# Altium schematic sheet Servo_driver.SchDoc
size A3
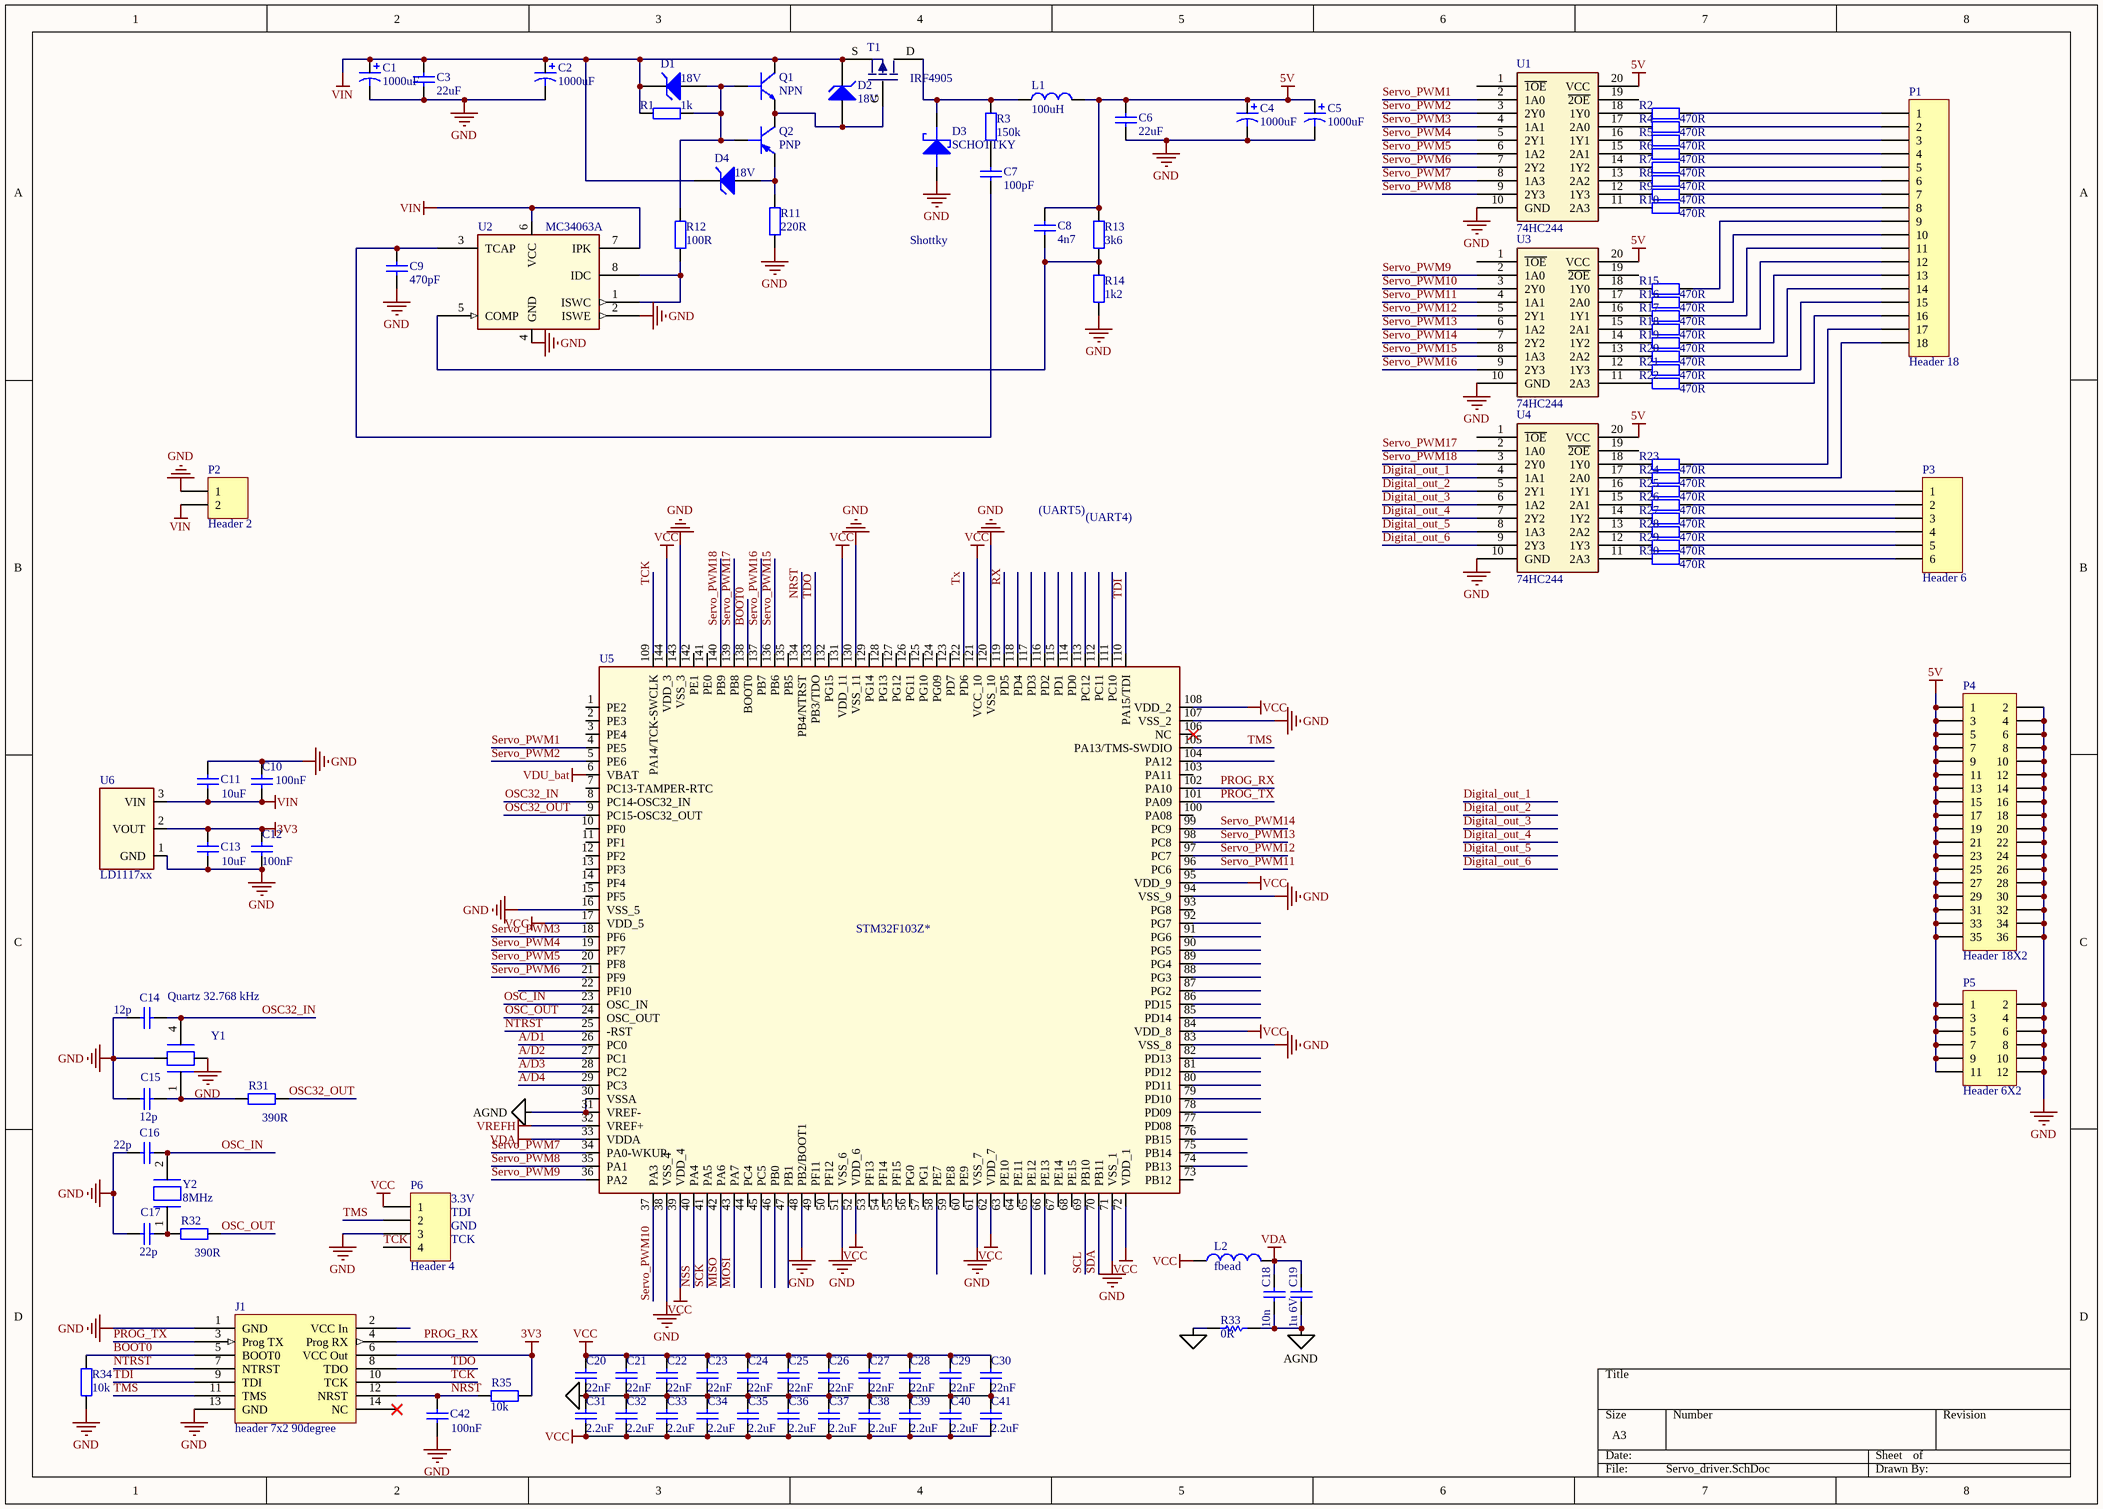
[diagram p0: Servo_driver.SchDoc]

## Parts
C1  1000uF  [cap_10x12]
C2  1000uF  [cap_10x12]
C3  22uF  [FP_1210_CAP_N]
C4  1000uF  [cap_10x12]
C5  1000uF  [cap_10x12]
C6  22uF  [FP_1210_CAP_N]
C7  100pF  [FP_0603_CAP_080]
C8  4n7  [FP_0603_CAP_080]
C9  470pF  [FP_0603_CAP_080]
C10  100nF  [FP_0603_CAP_080]
C11  10uF  [FP_1206_CAP_085]
C12  100nF  [FP_0603_CAP_080]
C13  10uF  [FP_1206_CAP_085]
C14  12p  [FP_0603_CAP_080]
C15  12p  [FP_0603_CAP_080]
C16  22p  [FP_0603_CAP_080]
C17  22p  [FP_0603_CAP_080]
C18  10n  [FP_0603_CAP_080]
C19  1u 6V  [FP_0603_CAP_080]
C20  22nF  [FP_0603_CAP_080]
C21  22nF  [FP_0603_CAP_080]
C22  22nF  [FP_0603_CAP_080]
C23  22nF  [FP_0603_CAP_080]
C24  22nF  [FP_0603_CAP_080]
C25  22nF  [FP_0603_CAP_080]
C26  22nF  [FP_0603_CAP_080]
C27  22nF  [FP_0603_CAP_080]
C28  22nF  [FP_0603_CAP_080]
C29  22nF  [FP_0603_CAP_080]
C30  22nF  [FP_0603_CAP_080]
C31  2.2uF  [FP_0603_CAP_080]
C32  2.2uF  [FP_0603_CAP_080]
C33  2.2uF  [FP_0603_CAP_080]
C34  2.2uF  [FP_0603_CAP_080]
C35  2.2uF  [FP_0603_CAP_080]
C36  2.2uF  [FP_0603_CAP_080]
C37  2.2uF  [FP_0603_CAP_080]
C38  2.2uF  [FP_0603_CAP_080]
C39  2.2uF  [FP_0603_CAP_080]
C40  2.2uF  [FP_0603_CAP_080]
C41  2.2uF  [FP_0603_CAP_080]
C42  100nF  [FP_0603_CAP_080]
D1  18V  [SOD-80]
D2  18V  [SOD-80]
D3  SCHOTTKY  [DIODE_TO220]
D4  18V  [SOD-80]
J1  header 7x2 90degree  [SMD_header_2x7_narrow]
L1  100uH  [SRR1206_T]
L2  fbead  [FP_0805_RES_SIMPLE]
P1  Header 18  [HDR1X18]
P2  Header 2  [Sorkapocs 2P 5mm]
P3  Header 6  [HDR1X6]
P4  Header 18X2  [HDR2X18]
P5  Header 6X2  [HDR2X6]
P6  Header 4  [HDR1X4]
Q1  NPN  [TR_SOT23]
Q2  PNP  [TR_SOT23]
R1  1k  [FP_1206_RES]
R2  470R  [FP_0603_RES]
R3  150k  [FP_0603_RES]
R4  470R  [FP_0603_RES]
R5  470R  [FP_0603_RES]
R6  470R  [FP_0603_RES]
R7  470R  [FP_0603_RES]
R8  470R  [FP_0603_RES]
R9  470R  [FP_0603_RES]
R10  470R  [FP_0603_RES]
R11  220R  [FP_1206_RES]
R12  100R  [FP_1206_RES]
R13  3k6  [FP_0603_RES]
R14  1k2  [FP_0603_RES]
R15  470R  [FP_0603_RES]
R16  470R  [FP_0603_RES]
R17  470R  [FP_0603_RES]
R18  470R  [FP_0603_RES]
R19  470R  [FP_0603_RES]
R20  470R  [FP_0603_RES]
R21  470R  [FP_0603_RES]
R22  470R  [FP_0603_RES]
R23  470R  [FP_0603_RES]
R24  470R  [FP_0603_RES]
R25  470R  [FP_0603_RES]
R26  470R  [FP_0603_RES]
R27  470R  [FP_0603_RES]
R28  470R  [FP_0603_RES]
R29  470R  [FP_0603_RES]
R30  470R  [FP_0603_RES]
R31  390R  [FP_0603_RES]
R32  390R  [FP_0603_RES]
R33  0R  [FP_0603_RES]
R34  10k  [FP_0603_RES]
R35  10k  [FP_0603_RES]
T1  IRF4905  [FET_TO220]
U1  74HC244  [DIGITAL_SOIC20W]
U2  MC34063A  [FP_SO8_MS012AA]
U3  74HC244  [DIGITAL_SOIC20W]
U4  74HC244  [DIGITAL_SOIC20W]
U5  STM32F103Z*  [LQFP144]
U6  LD1117xx  [SUPPLY_SOT223]
Y1  Quartz 32.768 kHz  [XTAL_ABS25]
Y2  value 8MHz  [FP_CRYSTAL_HC49_SMD]  (hidden comment: 8MHz Quartz HC49)

## Nets
3V3: C12.1 C13.2 J1.6(VCC_Out) R35.2 U6.2(VOUT)
5V: C4.P C5.P C6.2 C8.2 L1.2 P4.1 P4.3 P4.5 P4.7 P4.9 P4.11 P4.13 P4.15 P4.17 P4.19 P4.21 P4.23 P4.25 P4.27 P4.29 P4.31 P4.33 P4.35 P5.1 P5.3 P5.5 P5.7 P5.9 P5.11 R13.2 U1.20(VCC) U3.20(VCC) U4.20(VCC)
AGND: C18.1 C19.1 R33.1 U5.30(VSSA) U5.31(VREF-)
GND: C1.N C2.N C3.1 C4.N C5.N C6.1 C9.2 C10.1 C11.2 C12.2 C13.1 C14.1 C15.1 C16.1 C17.1 C20.1 C21.1 C22.1 C23.1 C24.1 C25.1 C26.1 C27.1 C28.1 C29.1 C30.1 C31.2 C32.2 C33.2 C34.2 C35.2 C36.2 C37.2 C38.2 C39.2 C40.2 C41.2 C42.2 D3.A J1.1(GND) J1.13(GND) P2.1 P4.2 P4.4 P4.6 P4.8 P4.10 P4.12 P4.14 P4.16 P4.18 P4.20 P4.22 P4.24 P4.26 P4.28 P4.30 P4.32 P4.34 P4.36 P5.2 P5.4 P5.6 P5.8 P5.10 P5.12 P6.3 R11.1 R14.1 R33.2 R34.2 U1.10(GND) U2.2(ISWE) U2.4(GND) U3.10(GND) U4.10(GND) U5.16(VSS_5) U5.38(VSS_4) U5.48(PB2/BOOT1) U5.51(VSS_6) U5.61(VSS_7) U5.71(VSS_1) U5.83(VSS_8) U5.94(VSS_9) U5.107(VSS_2) U5.120(VSS_10) U5.130(VSS_11) U5.143(VSS_3) U6.1(GND) Y1.2 Y1.3
VCC: C20.2 C21.2 C22.2 C23.2 C24.2 C25.2 C26.2 C27.2 C28.2 C29.2 C30.2 C31.1 C32.1 C33.1 C34.1 C35.1 C36.1 C37.1 C38.1 C39.1 C40.1 C41.1 L2.1 P6.1 U5.17(VDD_5) U5.39(VDD_4) U5.52(VDD_6) U5.62(VDD_7) U5.72(VDD_1) U5.84(VDD_8) U5.95(VDD_9) U5.108(VDD_2) U5.121(VCC_10) U5.131(VDD_11) U5.144(VDD_3)
VDA: C18.2 C19.2 L2.2 U5.33(VDDA)
VDU_bat: U5.6(VBAT)
VIN: C1.P C2.P C3.2 C10.2 C11.1 D1.K D2.K D4.K P2.2 Q1.C R1.2 T1.S U2.6(VCC) U2.7(IPK) U6.3(VIN)
VREFH: U5.32(VREF+)
A/D1: U5.26(PC0)
A/D2: U5.27(PC1)
A/D3: U5.28(PC2)
A/D4: U5.29(PC3)
BOOT0: J1.5(BOOT0) R34.1 U5.138(BOOT0)
Digital_out_1: U4.4(1A1)
Digital_out_2: U4.5(2Y1)
Digital_out_3: U4.6(1A2)
Digital_out_4: U4.7(2Y2)
Digital_out_5: U4.8(1A3)
Digital_out_6: U4.9(2Y3)
MISO: U5.42(PA6)
MOSI: U5.43(PA7)
NRST: C42.1 J1.12(NRST) R35.1 U5.134(PB4/NTRST)
NSS: U5.40(PA4)
NTRST: J1.7(NTRST) U5.25(-RST)
OSC32_IN: C14.2 U5.8(PC14-OSC32_IN) Y1.4
OSC32_OUT: R31.1 U5.9(PC15-OSC32_OUT)
OSC_IN: C16.2 U5.23(OSC_IN) Y2.2
OSC_OUT: R32.1 U5.24(OSC_OUT)
PROG_RX: J1.4(Prog_RX) U5.102(PA10)
PROG_TX: J1.3(Prog_TX) U5.101(PA09)
RX: U5.119(PD5)
SCK: U5.41(PA5)
SCL: U5.69(PB10)
SDA: U5.70(PB11)
Servo_PWM1: U1.2(1A0) U5.4(PE5)
Servo_PWM2: U1.3(2Y0) U5.5(PE6)
Servo_PWM3: U1.4(1A1) U5.18(PF6)
Servo_PWM4: U1.5(2Y1) U5.19(PF7)
Servo_PWM5: U1.6(1A2) U5.20(PF8)
Servo_PWM6: U1.7(2Y2) U5.21(PF9)
Servo_PWM7: U1.8(1A3) U5.34(PA0-WKUP)
Servo_PWM8: U1.9(2Y3) U5.35(PA1)
Servo_PWM9: U3.2(1A0) U5.36(PA2)
Servo_PWM10: U3.3(2Y0) U5.37(PA3)
Servo_PWM11: U3.4(1A1) U5.96(PC6)
Servo_PWM12: U3.5(2Y1) U5.97(PC7)
Servo_PWM13: U3.6(1A2) U5.98(PC8)
Servo_PWM14: U3.7(2Y2) U5.99(PC9)
Servo_PWM15: U3.8(1A3) U5.136(PB6)
Servo_PWM16: U3.9(2Y3) U5.137(PB7)
Servo_PWM17: U4.2(1A0) U5.139(PB8)
Servo_PWM18: U4.3(2Y0) U5.140(PB9)
TCK: J1.10(TCK) P6.4 U5.109(PA14/TCK-SWCLK)
TDI: J1.9(TDI) U5.110(PA15/TDI)
TDO: J1.8(TDO) U5.133(PB3/TDO)
TMS: J1.11(TMS) P6.2 U5.105(PA13/TMS-SWDIO)
Tx: U5.122(PD6)
NetC7_1: C7.1 R3.2
NetC7_2: C7.2 C9.1 U2.3(TCAP)
NetC8_1: C8.1 R13.1 R14.2 U2.5(COMP)
NetC15_2: C15.2 R31.2 Y1.1
NetC17_2: C17.2 R32.2 Y2.1
NetD1_A: D1.A Q1.B Q2.B R1.1 R12.2
NetD2_A: D2.A Q1.E Q2.C T1.G
NetD3_K: D3.K L1.1 R3.1 T1.D
NetD4_A: D4.A Q2.E R11.2
NetP1_1: P1.1 R2.2
NetP1_2: P1.2 R4.2
NetP1_3: P1.3 R5.2
NetP1_4: P1.4 R6.2
NetP1_5: P1.5 R7.2
NetP1_6: P1.6 R8.2
NetP1_7: P1.7 R9.2
NetP1_8: P1.8 R10.2
NetP1_9: P1.9 R15.2
NetP1_10: P1.10 R16.2
NetP1_11: P1.11 R17.2
NetP1_12: P1.12 R18.2
NetP1_13: P1.13 R19.2
NetP1_14: P1.14 R20.2
NetP1_15: P1.15 R21.2
NetP1_16: P1.16 R22.2
NetP1_17: P1.17 R23.2
NetP1_18: P1.18 R24.2
NetP3_1: P3.1 R25.2
NetP3_2: P3.2 R26.2
NetP3_3: P3.3 R27.2
NetP3_4: P3.4 R28.2
NetP3_5: P3.5 R29.2
NetP3_6: P3.6 R30.2
NetR2_1: R2.1 U1.18(1Y0)
NetR4_1: R4.1 U1.17(2A0)
NetR5_1: R5.1 U1.16(1Y1)
NetR6_1: R6.1 U1.15(2A1)
NetR7_1: R7.1 U1.14(1Y2)
NetR8_1: R8.1 U1.13(2A2)
NetR9_1: R9.1 U1.12(1Y3)
NetR10_1: R10.1 U1.11(2A3)
NetR12_1: R12.1 U2.1(ISWC) U2.8(IDC)
NetR15_1: R15.1 U3.18(1Y0)
NetR16_1: R16.1 U3.17(2A0)
NetR17_1: R17.1 U3.16(1Y1)
NetR18_1: R18.1 U3.15(2A1)
NetR19_1: R19.1 U3.14(1Y2)
NetR20_1: R20.1 U3.13(2A2)
NetR21_1: R21.1 U3.12(1Y3)
NetR22_1: R22.1 U3.11(2A3)
NetR23_1: R23.1 U4.18(1Y0)
NetR24_1: R24.1 U4.17(2A0)
NetR25_1: R25.1 U4.16(1Y1)
NetR26_1: R26.1 U4.15(2A1)
NetR27_1: R27.1 U4.14(1Y2)
NetR28_1: R28.1 U4.13(2A2)
NetR29_1: R29.1 U4.12(1Y3)
NetR30_1: R30.1 U4.11(2A3)

Not connected (* = marked no-connect by the designer): J1 2(VCC_In) 14(NC)*; U1 1(~{1OE}) 19(~{2OE}); U3 1(~{1OE}) 19(~{2OE}); U4 1(~{1OE}) 19(~{2OE}); U5 1(PE2) 2(PE3) 3(PE4) 7(PC13-TAMPER-RTC) 10(PF0) 11(PF1) 12(PF2) 13(PF3) 14(PF4) 15(PF5) 22(PF10) 44(PC4) 45(PC5) 46(PB0) 47(PB1) 49(PF11) 50(PF12) 53(PF13) 54(PF14) 55(PF15) 56(PG0) 57(PG1) 58(PE7) 59(PE8) 60(PE9) 63(PE10) 64(PE11) 65(PE12) 66(PE13) 67(PE14) 68(PE15) 73(PB12) 74(PB13) 75(PB14) 76(PB15) 77(PD08) 78(PD09) 79(PD10) 80(PD11) 81(PD12) 82(PD13) 85(PD14) 86(PD15) 87(PG2) 88(PG3) 89(PG4) 90(PG5) 91(PG6) 92(PG7) 93(PG8) 100(PA08) 103(PA11) 104(PA12) 106(NC)* 111(PC10) 112(PC11) 113(PC12) 114(PD0) 115(PD1) 116(PD2) 117(PD3) 118(PD4) 123(PD7) 124(PG09) 125(PG10) 126(PG11) 127(PG12) 128(PG13) 129(PG14) 132(PG15) 135(PB5) 141(PE0) 142(PE1)

## Notes on the sheet
- Shottky
- (UART5)
- (UART4)
- (near P6) TDI
- (near P6) TCK
- (near P6) 3.3V
- (near P6) GND

## Library data of the parts
C1 C2 C4 C5 = CAP_ELECT: Polarized Capacitor; Value: 1000uF
C3 C6 = CAP: Capacitor; Tûrés: 20% X7R; Value: 22uF; Order info: http://www.tme.eu/hu/details/cl32a226kojnnne/mlcc-smd-1210-kondenzatorok/samsung/
C7 = Cap: Capacitor; Order info: L: 82-02-26; Tûrés: 10%; Published: 8-Jun-2000; LatestRevisionDate: 17-Jul-2002; LatestRevisionNote: Re-released for DXP Platform.; PackageReference: RAD-0.3; Publisher: Altium Limited; Value: 100pF
C8 = Cap: Capacitor; Value: 100pF; Order info: TODO; Tûrés: 10%; Published: 8-Jun-2000; LatestRevisionDate: 17-Jul-2002; LatestRevisionNote: Re-released for DXP Platform.; PackageReference: RAD-0.3; Publisher: Altium Limited
C9 = Cap: Capacitor; Value: 100pF; Tûrés: 10% NP0; Published: 8-Jun-2000; LatestRevisionDate: 17-Jul-2002; LatestRevisionNote: Re-released for DXP Platform.; PackageReference: RAD-0.3; Publisher: Altium Limited; Order info: 82-02-34
C10 C12 C14-C17 C42 = Cap: Capacitor; Order info: TODO; Tûrés: 10%; Published: 8-Jun-2000; LatestRevisionDate: 17-Jul-2002; LatestRevisionNote: Re-released for DXP Platform.; PackageReference: RAD-0.3; Publisher: Altium Limited
  C10 C12 C42: Value: 100nF
  C14 C15: Value: 12p
  C16 C17: Value: 22p
C11 C13 = Cap: Capacitor; Value: 100nF; Tûrés: 20% X7R; Order info: TODO; Published: 8-Jun-2000; LatestRevisionDate: 17-Jul-2002; LatestRevisionNote: Re-released for DXP Platform.; PackageReference: RAD-0.3; Publisher: Altium Limited; Order info: 82-07-81
C18 C19 = Cap: Capacitor; Value: 100nF; Published: 8-Jun-2000; LatestRevisionDate: 17-Jul-2002; LatestRevisionNote: Re-released for DXP Platform.; PackageReference: RAD-0.3; Publisher: Altium Limited
C20-C41 = Cap: Capacitor; Value: 100pF; Published: 8-Jun-2000; LatestRevisionDate: 17-Jul-2002; LatestRevisionNote: Re-released for DXP Platform.; PackageReference: RAD-0.3; Publisher: Altium Limited
D1 D2 D4 = ZENER: Zener Diode; U_Z: 24; Order info: L: 85-01-29
D3 = SCHOTTKY: NXP - PMEG3020EJ,115 - SCHOTTKY RECT 30V 2A SOD323F; Supplier: Farnell 1757772
J1 = ARM_JTAG_PROG: Order info: 2X7 pin SMD tüskesor, fél raszteresz; Order info: TODO
L1 = L: Order info: RET: 77-01-48  // lomex: 93-03-38
L2 = Inductor: Code_IEC: 1005; Published: 8-Jun-2000; LatestRevisionDate: 17-Jul-2002; LatestRevisionNote: Re-released for DXP Platform.; PackageReference: 0402-A; Publisher: Altium Limited; Code_JEITA: 0402; Value: FBEAD
P1 = Header 18: Header, 18-Pin; LatestRevisionDate: 17-Jul-2002; LatestRevisionNote: Re-released for DXP Platform.; Publisher: Altium Limited
P2 = Header 2: Header, 2-Pin; LatestRevisionDate: 17-Jul-2002; LatestRevisionNote: Re-released for DXP Platform.; Publisher: Altium Limited
P3 = Header 6: Header, 6-Pin; LatestRevisionDate: 17-Jul-2002; LatestRevisionNote: Re-released for DXP Platform.; Publisher: Altium Limited
P4 = Header 18X2: Header, 18-Pin, Dual row; LatestRevisionDate: 17-Jul-2002; LatestRevisionNote: Re-released for DXP Platform.; Publisher: Altium Limited
P5 = Header 6X2: Header, 6-Pin, Dual row; LatestRevisionDate: 17-Jul-2002; LatestRevisionNote: Re-released for DXP Platform.; Publisher: Altium Limited
P6 = Header 4: Header, 4-Pin; LatestRevisionDate: 17-Jul-2002; LatestRevisionNote: Re-released for DXP Platform.; Publisher: Altium Limited
R1 = Res3: Resistor; Order info: TODO; Tûrés: 5%; Published: 8-Jun-2000; LatestRevisionDate: 04-Mar-2005; LatestRevisionNote: PCB Footprint replaced.; PackageReference: J1-0603; Publisher: Altium Limited; Value: 1k
R2 R4-R10 R15-R30 = Res3: Resistor; Value: 1k; Published: 8-Jun-2000; LatestRevisionDate: 04-Mar-2005; LatestRevisionNote: PCB Footprint replaced.; PackageReference: J1-0603; Publisher: Altium Limited
R3 R11 R12 R34 R35 = Res3: Resistor; Value: 1k; Order info: TODO; Tûrés: 5%; Published: 8-Jun-2000; LatestRevisionDate: 04-Mar-2005; LatestRevisionNote: PCB Footprint replaced.; PackageReference: J1-0603; Publisher: Altium Limited
R13 R14 = Res3: Resistor; Value: 1k; Tûrés: 1%; Published: 8-Jun-2000; LatestRevisionDate: 04-Mar-2005; LatestRevisionNote: PCB Footprint replaced.; PackageReference: J1-0603; Publisher: Altium Limited
  R13: Order info: 80-14-47
  R14: Order info: 80-13-54
R31 R32 = Res3: Resistor; Value: 390; Order info: TODO; Tûrés: 5%; Published: 8-Jun-2000; LatestRevisionDate: 04-Mar-2005; LatestRevisionNote: PCB Footprint replaced.; PackageReference: J1-0603; Publisher: Altium Limited
R33 = Res1: Resistor; Value: 1K; Published: 8-Jun-2000; LatestRevisionDate: 17-Jul-2002; LatestRevisionNote: Re-released for DXP Platform.; PackageReference: AXIAL-0.3; Publisher: Altium Limited
T1 = PMOS: Order info: mouser: 512-NDT2955
U1 U3 U4 = 74HC244: Octqal buffer 3-state line driver
U2 = MC34063A: Order info: mouser: 595-MC34063ADR
U5 = STM32F103Zxxx
U6 = LD1117xx: LD1117xx 3,3V lin reg; Order info: TODO; Order info: http://hu.mouser.com/ProductDetail/NXP/NX1117C33Z115/?qs=%2fha2pyFadui8%252bOpsKr9N%2fhvfdxjCMx%252bF0NTwqG%252bWOJY%3d
Y1 = XTAL_32,768khz ABS25 SMD: Order info: ugyanaz mint a feden
Y2 = XTAL HC49: Standard HC49 quartz; Manufacturer: Siward; Order info: ugyanaz mint a feden